# EAGLE design Main_board_revE (EAGLE 7.0.0)
DEDuino Main Board allows connection between an Arduino and the other components ive simple 6 pin cables
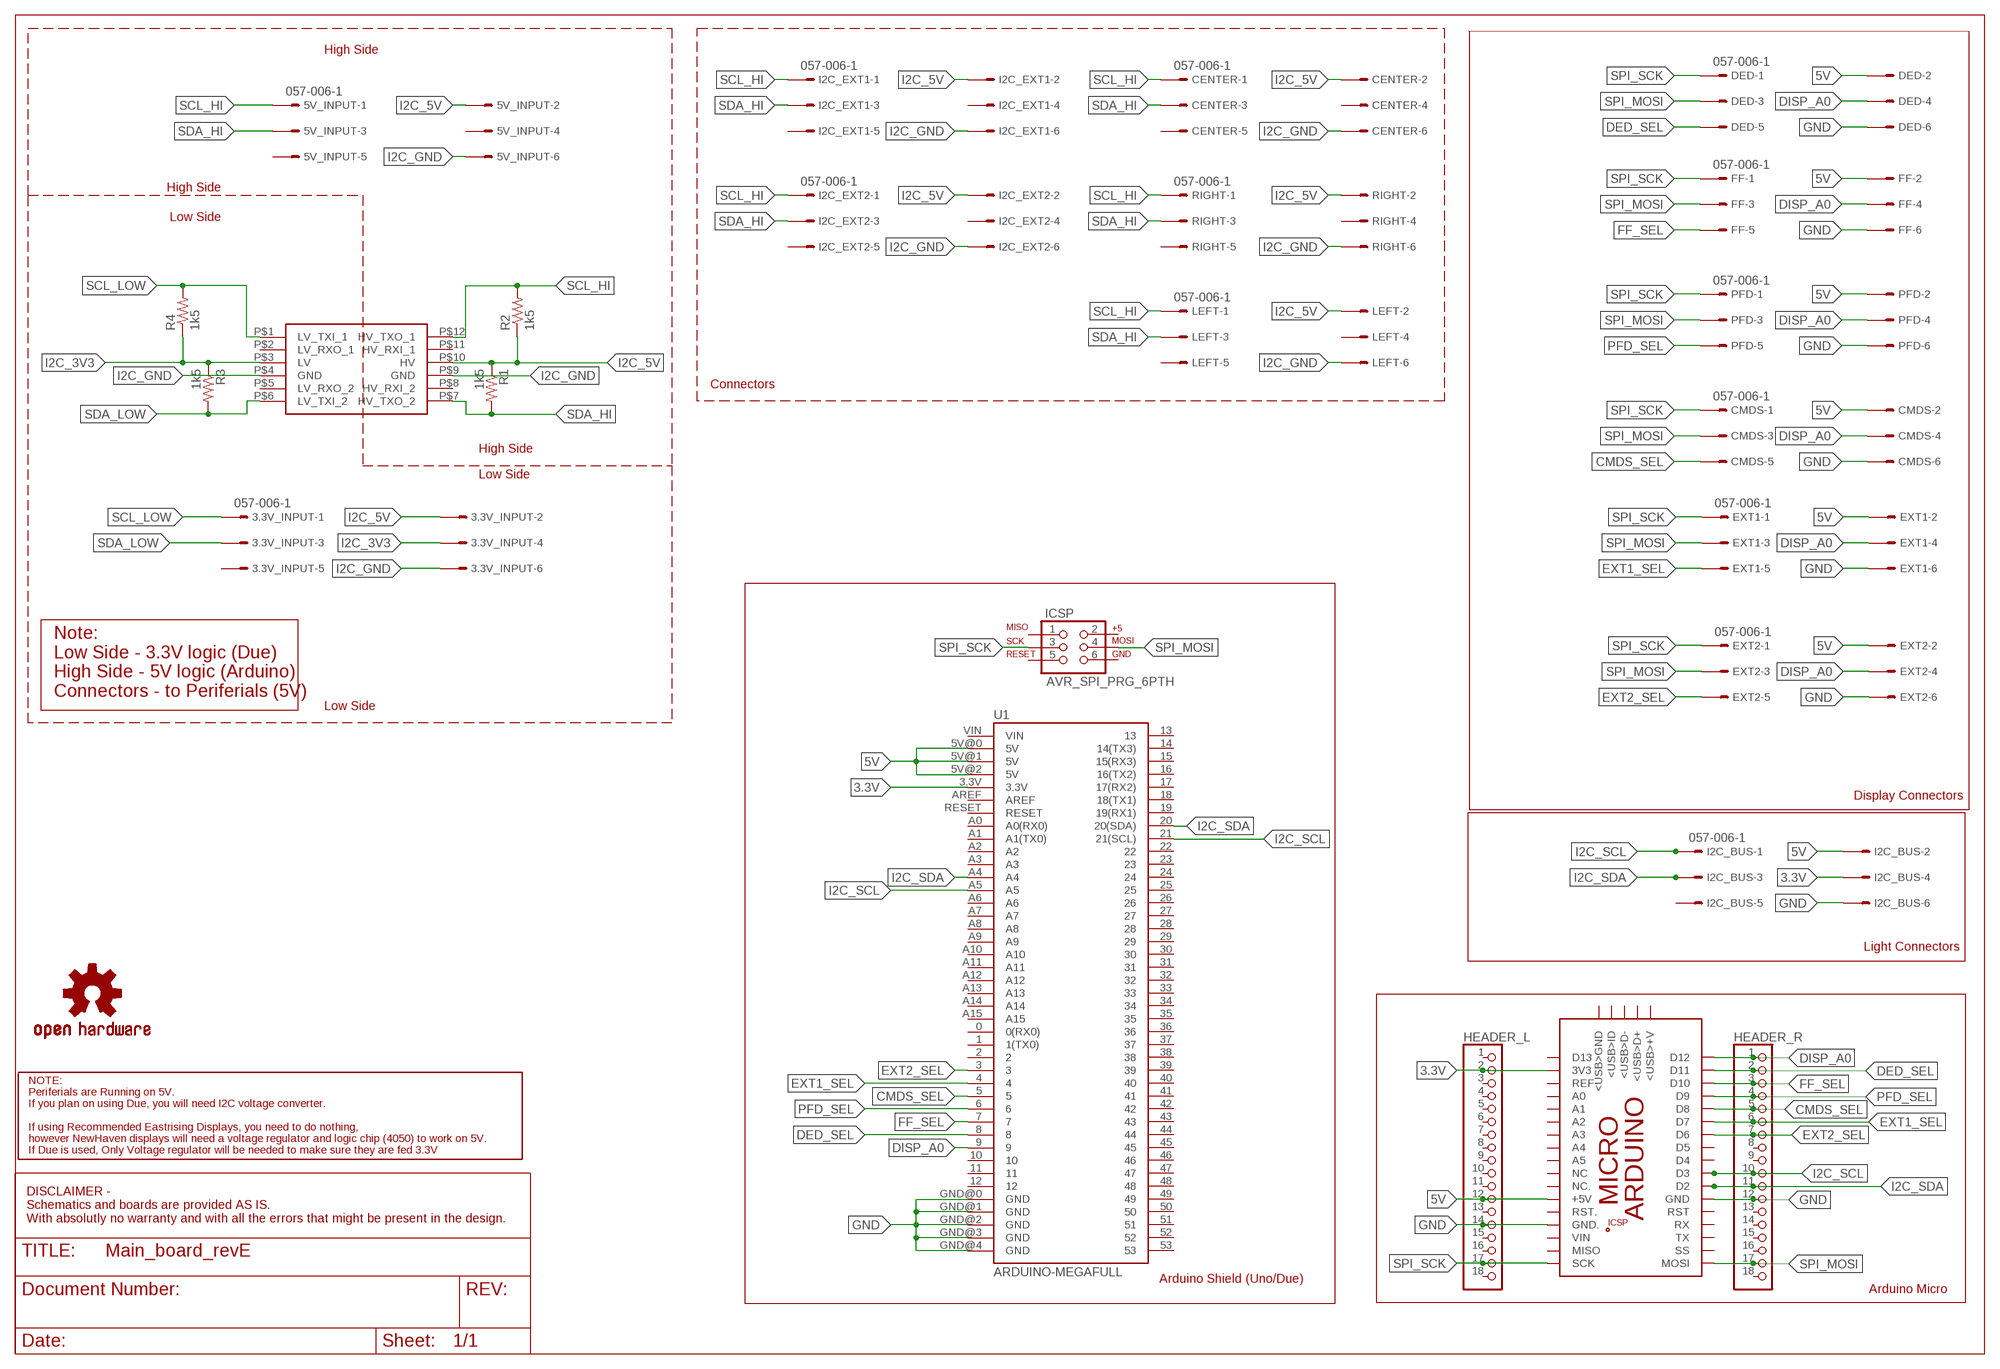
[diagram p0: schematic, sheet 1]

## Parts
3.3V_INPUT  057-006-1  [057-006-1]
5V_INPUT  057-006-1  [057-006-1]
CENTER  057-006-1  [057-006-1]
CMDS  057-006-1  [057-006-1]
DED  057-006-1  [057-006-1]
EXT1  057-006-1  [057-006-1]
EXT2  057-006-1  [057-006-1]
FF  057-006-1  [057-006-1]
HEADER_L  PINHD-1X18  [1X18]
HEADER_R  PINHD-1X18  [1X18]
I2C_BUS  057-006-1  [057-006-1]
I2C_EXT1  057-006-1  [057-006-1]
I2C_EXT2  057-006-1  [057-006-1]
ICSP  AVR_SPI_PRG_6PTH  [2X3]
LEFT  057-006-1  [057-006-1]
LOGO1  OSHW-LOGOM  [OSHW-LOGO-M]
PCB1  ARDUINO_MICRO_EXT  (no package)
PFD  057-006-1  [057-006-1]
R1  1k5  RESISTOR0805-RES  [0805]
R2  1k5  RESISTOR0805-RES  [0805]
R3  1k5  RESISTOR0805-RES  [0805]
R4  1k5  RESISTOR0805-RES  [0805]
RIGHT  057-006-1  [057-006-1]
U1  ARDUINO-MEGAFULL  [ARDUINO_MEGA]
U$1  LOGIC_LEVEL_CONVERTER  [LOGIC_LEVEL_CONVERTER]

## Nets
3.3V [Power]: HEADER_L.2 I2C_BUS.4 PCB1.3V3 U1.3.3V
5V [Power]: CMDS.2 DED.2 EXT1.2 EXT2.2 FF.2 HEADER_L.12 I2C_BUS.2 PCB1.+5V PFD.2 U1.5V@0(5V) U1.5V@1(5V) U1.5V@2(5V)
CMDS_SEL [Normal]: CMDS.5 HEADER_R.5 PCB1.D8 U1.5
DED_SEL [Normal]: DED.5 HEADER_R.2 PCB1.D11 U1.8
DISP_A0 [Normal]: CMDS.4 DED.4 EXT1.4 EXT2.4 FF.4 HEADER_R.1 PCB1.D12 PFD.4 U1.9
EXT1_SEL [Normal]: EXT1.5 HEADER_R.6 PCB1.D7 U1.4
EXT2_SEL: EXT2.5 HEADER_R.7 PCB1.D6 U1.3
FF_SEL [Normal]: FF.5 HEADER_R.3 PCB1.D10 U1.7
GND [Power]: CMDS.6 DED.6 EXT1.6 EXT2.6 FF.6 HEADER_L.14 HEADER_R.12 I2C_BUS.6 PCB1.GND PCB1.GND. PFD.6 U1.GND@0(GND) U1.GND@1(GND) U1.GND@2(GND) U1.GND@3(GND) U1.GND@4(GND)
I2C_3V3 [Power]: 3.3V_INPUT.4 R3.1 R4.1 U$1.P$3(LV)
I2C_5V [Power]: 3.3V_INPUT.2 5V_INPUT.2 CENTER.2 I2C_EXT1.2 I2C_EXT2.2 LEFT.2 R1.1 R2.1 RIGHT.2 U$1.P$10(HV)
I2C_GND [Power]: 3.3V_INPUT.6 5V_INPUT.6 CENTER.6 I2C_EXT1.6 I2C_EXT2.6 LEFT.6 RIGHT.6 U$1.P$4(GND) U$1.P$9(GND)
I2C_SCL [Normal]: HEADER_R.10 I2C_BUS.1 PCB1.D3 U1.21(21(SCL)) U1.A5
I2C_SDA [Normal]: HEADER_R.11 I2C_BUS.3 PCB1.D2 U1.20(20(SDA)) U1.A4
PFD_SEL [Normal]: HEADER_R.4 PCB1.D9 PFD.5 U1.6
SCL_HI [Normal]: 5V_INPUT.1 CENTER.1 I2C_EXT1.1 I2C_EXT2.1 LEFT.1 R2.2 RIGHT.1 U$1.P$12(HV_TXO_1)
SCL_LOW [Normal]: 3.3V_INPUT.1 R4.2 U$1.P$1(LV_TXI_1)
SDA_HI [Normal]: 5V_INPUT.3 CENTER.3 I2C_EXT1.3 I2C_EXT2.3 LEFT.3 R1.2 RIGHT.3 U$1.P$7(HV_TXO_2)
SDA_LOW [Normal]: 3.3V_INPUT.3 R3.2 U$1.P$6(LV_TXI_2)
SPI_MOSI [Normal]: CMDS.3 DED.3 EXT1.3 EXT2.3 FF.3 HEADER_R.17 ICSP.4 PCB1.MOSI PFD.3
SPI_SCK [Normal]: CMDS.1 DED.1 EXT1.1 EXT2.1 FF.1 HEADER_L.17 ICSP.3 PCB1.SCK PFD.1
Unconnected: 3.3V_INPUT.5 5V_INPUT.4 5V_INPUT.5 CENTER.4 CENTER.5 HEADER_L.1 HEADER_L.3 HEADER_L.4 HEADER_L.5 HEADER_L.6 HEADER_L.7 HEADER_L.8 HEADER_L.9 HEADER_L.10 HEADER_L.11 HEADER_L.13 HEADER_L.15 HEADER_L.16 HEADER_L.18 HEADER_R.8 HEADER_R.9 HEADER_R.13 HEADER_R.14 HEADER_R.15 HEADER_R.16 HEADER_R.18 I2C_BUS.5 I2C_EXT1.4 I2C_EXT1.5 I2C_EXT2.4 I2C_EXT2.5 ICSP.1 ICSP.2 ICSP.5 ICSP.6 LEFT.4 LEFT.5 PCB1.5V PCB1.<USB>+V PCB1.<USB>D+ PCB1.<USB>D- PCB1.<USB>GND PCB1.<USB>ID PCB1.A0 PCB1.A1 PCB1.A2 PCB1.A3 PCB1.A4 PCB1.A5 PCB1.D4 PCB1.D5 PCB1.D13 PCB1.GND_ PCB1.MISO PCB1.MISO. PCB1.MOSI. PCB1.NC PCB1.NC. PCB1.REF PCB1.RESET.. PCB1.RST PCB1.RST. PCB1.RX PCB1.SCK. PCB1.SS PCB1.TX PCB1.VIN RIGHT.4 RIGHT.5 U1.0(0(RX0)) U1.1(1(TX0)) U1.2 U1.10 U1.11 U1.12 U1.13 U1.14(14(TX3)) U1.15(15(RX3)) U1.16(16(TX2)) U1.17(17(RX2)) U1.18(18(TX1)) U1.19(19(RX1)) U1.22 U1.23 U1.24 U1.25 U1.26 U1.27 U1.28 U1.29 U1.30 U1.31 U1.32 U1.33 U1.34 U1.35 U1.36 U1.37 U1.38 U1.39 U1.40 U1.41 U1.42 U1.43 U1.44 U1.45 U1.46 U1.47 U1.48 U1.49 U1.50 U1.51 U1.52 U1.53 U1.A0(A0(RX0)) U1.A1(A1(TX0)) U1.A2 U1.A3 U1.A6 U1.A7 U1.A8 U1.A9 U1.A10 U1.A11 U1.A12 U1.A13 U1.A14 U1.A15 U1.AREF U1.RESET U1.VIN U$1.P$2(LV_RXO_1) U$1.P$5(LV_RXO_2) U$1.P$8(HV_RXI_2) U$1.P$11(HV_RXI_1)

## Notes on the sheet
- High Side
- High Side
- Low Side
- Connectors
- High Side
- Low Side
- Note:
  Low Side - 3.3V logic (Due)
  High Side - 5V logic (Arduino)
  Connectors - to Periferials (5V)
- Low Side
- Display Connectors
- Light Connectors
- NOTE:
  Periferials are Running on 5V.
  If you plan on using Due, you will need I2C voltage converter.
  
  If using Recommended Eastrising Displays, you need to do nothing,
  however NewHaven displays will need a voltage regulator and logic chip (4050) to work on 5V.
  If Due is used, Only Voltage regulator will be needed to make sure they are fed 3.3V
- DISCLAIMER - 
  Schematics and boards are provided AS IS.
  With absolutly no warranty and with all the errors that might be present in the design.
- Arduino Shield (Uno/Due)
- Arduino Micro

## Library data of the parts
3.3V_INPUT 5V_INPUT CENTER CMDS DED EXT1 EXT2 FF I2C_BUS I2C_EXT1 I2C_EXT2 LEFT PFD RIGHT = con-panduit:057-006-: CONNECTOR 6-pin series 057 contact pc board low profile headers; OC_FARNELL: unknown; OC_NEWARK: unknown
HEADER_L HEADER_R = pinhead:PINHD-1X18: PIN HEADER
ICSP = SparkFun-Connectors:AVR_SPI_PRG_6: AVR ISP 6 Pin This is the reduced ISP connector for AVR programming. Common on Arduino. This footprint will take up less PCB space and can be used with a 10-pin to 6-pin adapter such as SKU: BOB-08508 **Special note about "TEST_POINT" package. The stop mask is on the top side, so if you want your programming test points to be on the bottom of your board, make sure to place this package on the bottom side of the board. This also ensure that the orientation to program from the bottom side will be correct.
LOGO1 = SparkFun-Aesthetics:OSHW-LOGO: Open Source Hardware Logo This logo indicates the piece of hardware it is found on incorporates a OSHW license and/or adheres to the definition of open source hardware found here: http://freedomdefined.org/OSHW
PCB1 = E14_Arduino_published:ARDUINO_MICRO_EXT: Device for representing an Arduino Micro board in an EAGLE design without the PCB footprint. Created by Dave Young for Element14. More EAGLE documentation at: http://www.element14.com/community/community/knode/cadsoft_eagle
R1-R4 = SparkFun-Passives:RESISTOR: Resistor Basic schematic elements and footprints for 0603, 1206, and PTH resistors.
U1 = SparkFun-Boards:ARDUINO-MEGA: Arduino Mega board footprint
U$1 = SparkFun-Boards:LOGIC_LEVEL_CONVERTER: Logic Level Converter (3.3v - 5v) https://www.sparkfun.com/products/8745

## Net classes
1 Power: width 0.406 mm, drill 0.406 mm, clearance 0.406 mm
2 Normal: width 0.254 mm, drill 0.254 mm, clearance 0.254 mm

## Board
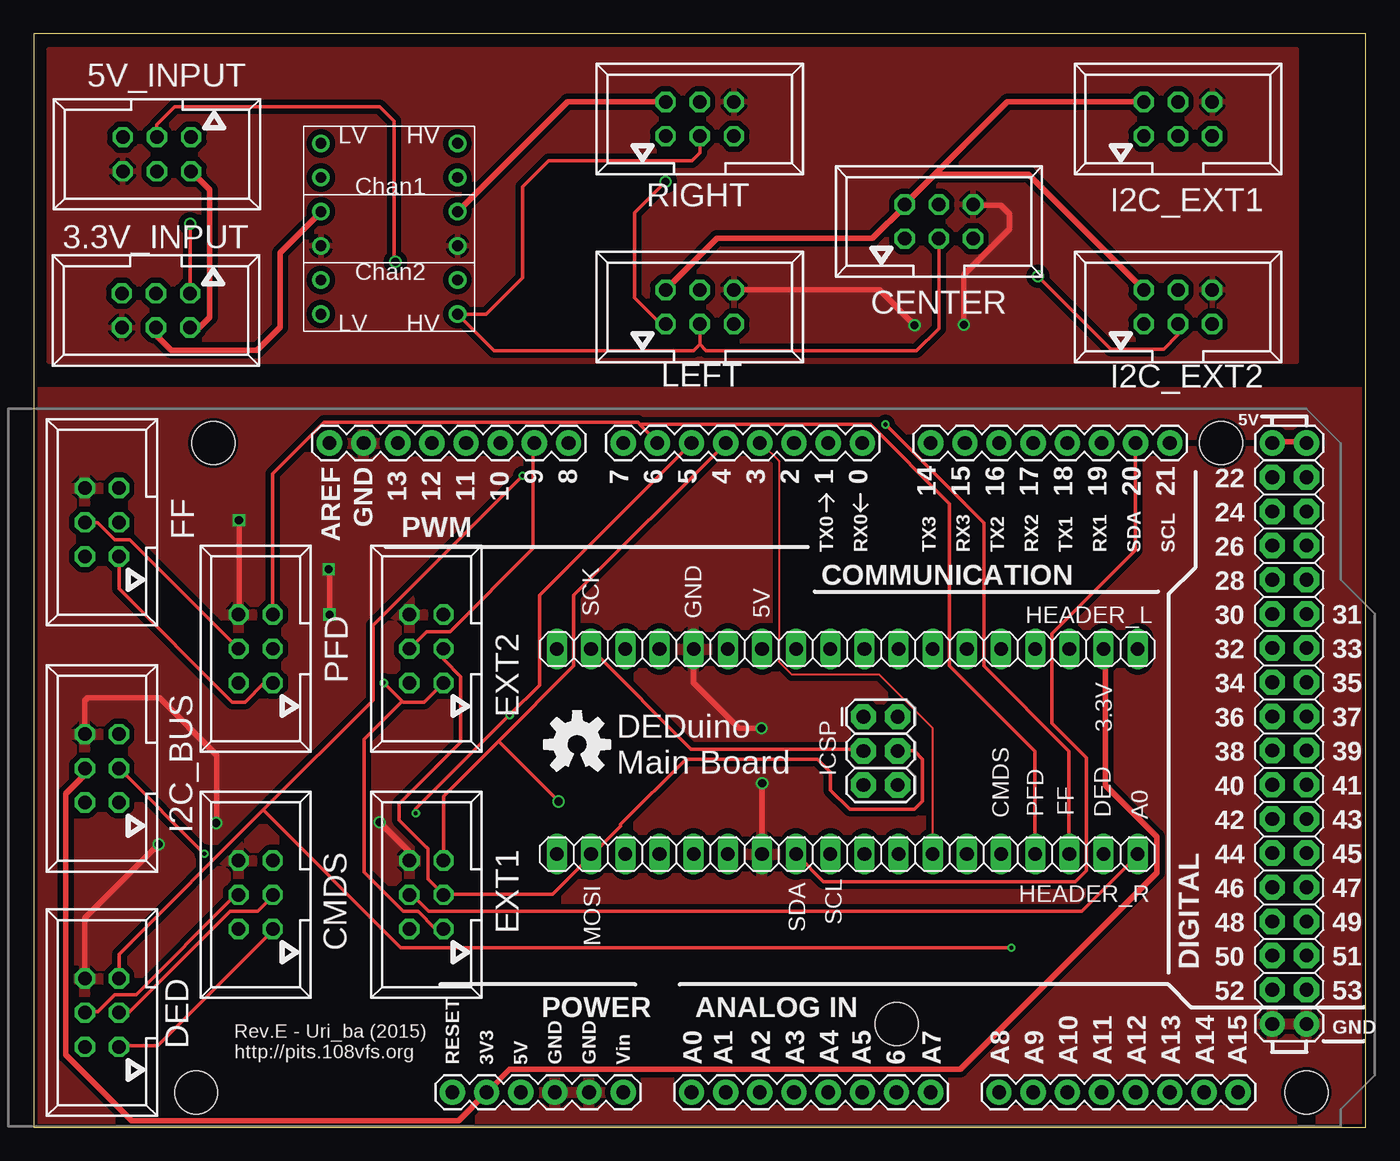
[diagram p1: board, top side]
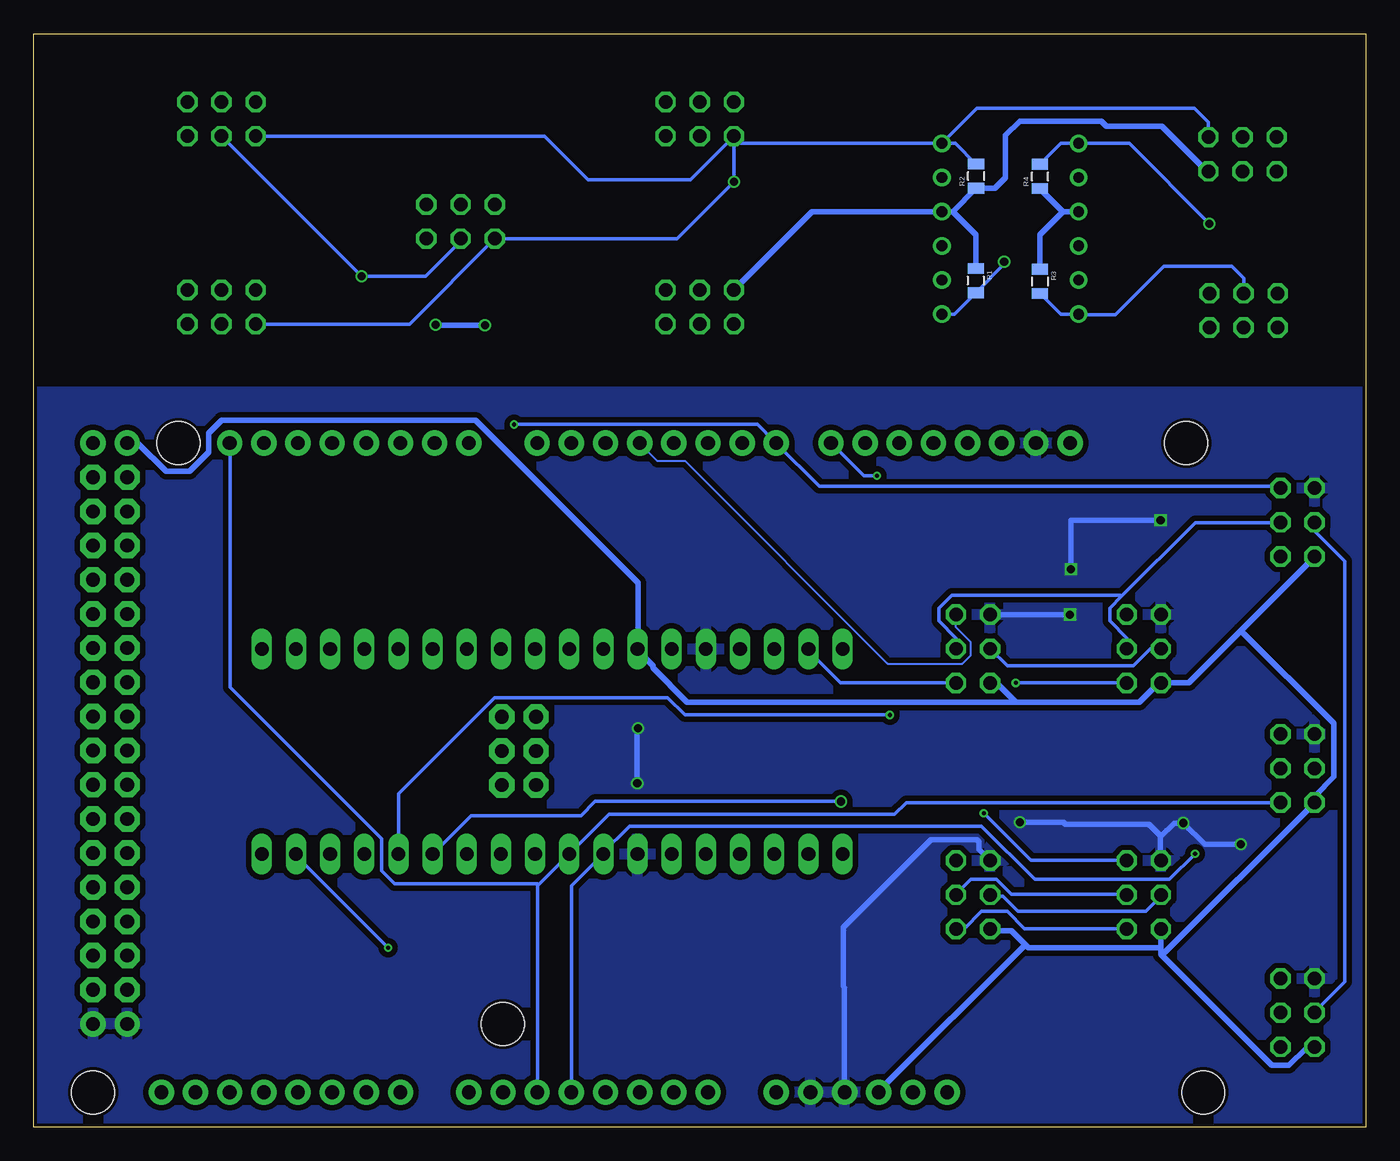
[diagram p2: board, bottom side, seen from below]

Size 99.06 x 81.28 mm. Coordinates in mm from the lower left corner, seen from the top.
Outline: 0,0 99.06,0 99.06,81.28 0,81.28 0,0
Copper layers (1*16): Top 0.035mm / dielectric 1.5mm / Bottom 0.035mm
Design rules "ITEADstudio_DRC": minimum track width 6mil, minimum drill 12mil, track to track 6mil, track to pad 6mil, pad to pad 6mil, via to via 6mil, smd to smd 0mil, copper to edge 10mil, drill to drill 10mil, minimum pad ring 10mil, minimum via ring 6mil, stop-mask expansion 2mil, vias tented up to drill 100mil, thermal gap 10mil

### Footprints (pad centres in the part's own frame; a part is rotated, then mirrored left to right if it is on the bottom)
057-006-1 = drill 1 octagon: 1 -2.54,-1.27; 2 -2.54,1.27; 3 0,-1.27; 4 0,1.27; 5 2.54,-1.27; 6 2.54,1.27
1X18 = drill 1.016 long: 1 -21.59,0; 2 -19.05,0; 3 -16.51,0; 4 -13.97,0; 5 -11.43,0; 6 -8.89,0; 7 -6.35,0; 8 -3.81,0; 9 -1.27,0; 10 1.27,0; 11 3.81,0; 12 6.35,0; 13 8.89,0; 14 11.43,0; 15 13.97,0; 16 16.51,0; 17 19.05,0; 18 21.59,0
2X3 = drill 1.016 pad 1.88 octagon: 1 0,0; 2 0,2.54; 3 2.54,0; 4 2.54,2.54; 5 5.08,0; 6 5.08,2.54
0805 = smd 0.8 x 1.2: 1 -0.9,0; 2 0.9,0
ARDUINO_MEGA = drill 1.016 pad 1.88: 0 63.5,50.8; 1 60.96,50.8; 2 58.42,50.8; 3 55.88,50.8; 3.3V 35.56,2.54; 4 53.34,50.8; 5 50.8,50.8; 5V@0 38.1,2.54; 5V@1 93.98,50.8; 5V@2 96.52,50.8; 6 48.26,50.8; 7 45.72,50.8; 8 41.656,50.8; 9 39.116,50.8; 10 36.576,50.8; 11 34.036,50.8; 12 31.496,50.8; 13 28.956,50.8; 14 68.58,50.8; 15 71.12,50.8; 16 73.66,50.8; 17 76.2,50.8; 18 78.74,50.8; 19 81.28,50.8; 20 83.82,50.8; 21 86.36,50.8; A0 50.8,2.54; A1 53.34,2.54; A2 55.88,2.54; A3 58.42,2.54; A4 60.96,2.54; A5 63.5,2.54; A6 66.04,2.54; A7 68.58,2.54; A8 73.66,2.54; A9 76.2,2.54; A10 78.74,2.54; A11 81.28,2.54; A12 83.82,2.54; A13 86.36,2.54; A14 88.9,2.54; A15 91.44,2.54; AREF 23.876,50.8; GND@0 40.64,2.54; GND@1 43.18,2.54; GND@2 93.98,7.62; GND@3 96.52,7.62; GND@4 26.416,50.8; RESET 33.02,2.54; VIN 45.72,2.54 | drill 1.016 pad 1.88 octagon: 22 93.98,48.26; 23 96.52,48.26; 24 93.98,45.72; 25 96.52,45.72; 26 93.98,43.18; 27 96.52,43.18; 28 93.98,40.64; 29 96.52,40.64; 30 93.98,38.1; 31 96.52,38.1; 32 93.98,35.56; 33 96.52,35.56; 34 93.98,33.02; 35 96.52,33.02; 36 93.98,30.48; 37 96.52,30.48; 38 93.98,27.94; 39 96.52,27.94; 40 93.98,25.4; 41 96.52,25.4; 42 93.98,22.86; 43 96.52,22.86; 44 93.98,20.32; 45 96.52,20.32; 46 93.98,17.78; 47 96.52,17.78; 48 93.98,15.24; 49 96.52,15.24; 50 93.98,12.7; 51 96.52,12.7; 52 93.98,10.16; 53 96.52,10.16 | hole 3.2: 15.24,50.8; 13.97,2.54; 66.04,7.62; 90.17,50.8; 96.52,2.54
LOGIC_LEVEL_CONVERTER = drill 0.8: P$1 1.27,13.97; P$2 1.27,11.43; P$3 1.27,8.89; P$4 1.27,6.35; P$5 1.27,3.81; P$6 1.27,1.27; P$7 11.43,1.27; P$8 11.43,3.81; P$9 11.43,6.35; P$10 11.43,8.89; P$11 11.43,11.43; P$12 11.43,13.97

### Placement (x,y rotation side)
3.3V_INPUT  9.09,60.71 180 top
5V_INPUT  9.17,72.31 180 top
CENTER  67.31,67.31 0 top
CMDS  16.51,17.27 90 top
DED  5.08,8.51 90 top
EXT1  29.21,17.27 90 top
EXT2  29.21,35.56 90 top
FF  5.08,44.96 90 top
HEADER_L  60.5,35.53 180 top
HEADER_R  60.5,20.29 180 top
I2C_BUS  5.08,26.67 90 top
I2C_EXT1  85.09,74.93 0 top
I2C_EXT2  85.09,60.96 0 top
ICSP  61.7,30.51 270 top
LEFT  49.53,60.96 0 top
LOGO1  40.41,28.45 0 top
PFD  16.51,35.56 90 top
R1  29.01,62.92 270 bottom
R2  28.98,70.69 90 bottom
R3  24.23,62.87 270 bottom
R4  24.23,70.66 90 bottom
RIGHT  49.53,74.93 0 top
U1  -1.88,0.05 0 top
U$1  20.09,59.16 0 top

### Tracks (layer width: path | path; a pad name or v marks a point on that pad's centre or on a via)
3.3V
  Top 0.406: I2C_BUS.4 3.81,26.19 2.38,24.77 2.38,5.4 7.3,0.48 31.59,0.48 33.66,2.54 U1.3.3V 33.81,2.7 35.4,4.29 68.9,4.29 83.5,18.89 83.5,21.59 79.69,25.4 79.69,35.4 HEADER_L.2
5V
  Top 0.406: U1.5V@1 92.23,50.96 94.61,50.96 U1.5V@2
  Bottom 0.406: 15.16,12.78 15.24,12.86 15.24,13.34 | 15.16,12.78 6.99,4.6 5.71,4.6 4.45,5.87 3.81,5.87 DED.2 | CMDS.2 15.24,13.34 | 15.16,12.78 I2C_BUS.2 3.81,24.61 2.38,26.04 2.38,30 9.29,36.91 | 25.32,13.57 25.08,13.34 15.24,13.34 | 25.32,13.57 26.35,14.61 27.94,14.61 EXT1.2 | 25.32,13.57 36.2,2.7 U1.5V@0 | 9.29,36.91 3.81,42.39 FF.2 | 9.29,36.91 13.18,33.02 PFD.2 15.4,33.02 16.83,31.59 26.04,31.59 26.11,31.67 | EXT2.2 27.46,33.02 26.11,31.67 | 26.11,31.67 26.19,31.59 50.48,31.59 53.02,34.13 53.02,34.29 54.13,35.4 HEADER_L.12 54.13,35.72 54.13,40.48 66.2,52.55 85.09,52.55 86.04,51.59 86.04,50.16 87.47,48.74 89.22,48.74 91.28,50.8 92.08,50.8 U1.5V@1
CMDS_SEL  (via drill 0.3)
  Top 0.254: v28.42,23.34 28.42,23.65 v35.4,30.64 37.62,32.86 37.62,39.53 48.9,50.8 U1.5
  Bottom 0.254: v28.42,23.34 24.92,19.84 17.78,19.84 CMDS.5 | v35.4,30.64 50.64,30.64 51.91,31.91 64.77,31.91 71.91,24.77 71.91,20.32 HEADER_R.5
DED_SEL  (via drill 0.3)
  Top 0.254: DED.5 6.35,12.86 17.07,23.57 | 17.07,23.57 25.24,31.75 25.24,37.31 v36.35,48.42 | v72.71,13.34 27.3,13.34 17.07,23.57
  Bottom 0.254: v36.35,48.42 37.31,48.42 39.69,50.8 U1.8 | v72.71,13.34 79.53,20.16 HEADER_R.2
DISP_A0
  Top 0.254: PFD.4 7.14,43.66 6.03,43.66 4.76,44.93 3.81,44.93 FF.4 | EXT2.4 29.21,36.83 30.96,36.83 37.15,43.02 37.15,50.8 U1.9 | DED.4 3.81,8.57 4.76,8.57 6.03,9.84 7.62,9.84 14.92,17.14 15.24,17.14 CMDS.4 | HEADER_R.1 82.07,20.16 77.95,16.03 29.37,16.03 28.26,17.14 27.94,17.14 EXT1.4
  Bottom 0.254: PFD.4 16.03,35.56 17.3,34.29 26.67,34.29 EXT2.4 | EXT1.4 27.94,17.14 26.99,17.14 25.88,16.03 16.35,16.03 15.24,17.14 CMDS.4 | FF.4 3.81,44.29 1.59,42.07 1.59,10.79 3.81,8.57 DED.4
EXT1_SEL  (via drill 0.6)
  Top 0.254: EXT1.5 30.48,24.61 34.57,28.7 | 34.57,28.7 40.16,34.29 40.16,39.53 51.44,50.8 U1.4 | v39.04,24.21 39.04,24.23 34.57,28.7
  Bottom 0.254: 69.37,20.32 HEADER_R.6 66.52,23.16 58.37,23.16 57.33,24.21 v39.04,24.21
EXT2_SEL
  Top 0.152: HEADER_R.7 66.83,20.32 66.83,29.69 62.87,33.66 56.36,33.66 55.4,34.61 55.4,49.53 54.13,50.8 U1.3
  Bottom 0.152: EXT2.5 30.48,37.15 29.37,36.04 29.37,35.08 30,34.45 35.56,34.45 50.64,49.53 52.7,49.53 53.98,50.8 U1.3
FF_SEL  (via drill 0.3)
  Top 0.254: v63.34,52.23 70.64,44.93 70.64,34.29 76.99,27.94 76.99,20.32 HEADER_R.3
  Bottom 0.254: FF.5 6.35,47.62 40.64,47.62 43.81,50.8 U1.7 43.97,50.96 45.24,52.23 v63.34,52.23
GND  (via drill 0.6)
  Top 0.406: PFD.6 15.27,38.1 v15.27,45.11 | v21.95,41.48 22,41.48 v22,38.1 | EXT1.6 27.94,20.45 v25.73,22.66 | HEADER_R.12 54.15,25.53 v54.18,25.55 | v54.13,29.64 52.45,29.64 49.07,33.02 49.07,34.54 49.12,34.59 49.12,35.48 HEADER_L.14 | I2C_BUS.6 3.81,31.7 4.01,31.9 9.37,31.9 13.61,27.66 13.61,22.66 v13.56,22.61 | DED.6 3.81,15.54 v9.3,21.03
  Bottom 0.406: v15.27,45.11 21.95,45.11 v21.95,41.48 | v22,38.1 EXT2.6 | U1.GND@0 38.76,10.36 38.86,10.46 38.86,14.86 32.36,21.36 28.93,21.36 28.78,21.21 28.78,20.65 EXT1.6 | v25.73,22.66 22.48,22.66 22.35,22.53 16.13,22.53 15.27,21.67 15.27,21.59 | 15.27,21.59 15.27,19.84 CMDS.6 | v54.18,25.55 54.18,29.59 v54.13,29.64 | 15.27,21.59 14.25,22.61 v13.56,22.61 11.99,21.03 v9.3,21.03
  pour Bottom: -1.27,54.61 102.87,54.61 102.87,-1.27 -1.27,-1.27
  pour Top: 0,54.61 101.6,54.61 101.6,0 0,0
I2C_3V3
  Top 0.406: 3.3V_INPUT.4 9.09,58.9 10.24,57.76 16.61,57.76 18.31,59.46 18.31,65 U$1.P$3
  Bottom 0.406: R4.1 22.52,68.05 | 22.52,68.05 U$1.P$3 | R3.1 24.23,66.33 22.52,68.05
I2C_5V
  Top 0.406: 3.3V_INPUT.2 12.32,59.44 13.08,60.2 13.08,69.67 5V_INPUT.2 | 67,70.81 CENTER.2 64.77,68.45 62.38,66.06 50.83,66.06 LEFT.2 | 67,70.81 72.39,76.2 I2C_EXT1.2 | I2C_EXT2.2 73.97,70.81 67,70.81 | RIGHT.2 47.02,76.22 | 47.02,76.22 47.07,76.22 | 47.02,76.22 39.7,76.22 U$1.P$10
  Bottom 0.406: 30.72,68.05 R2.1 27.58,69.8 26.8,70.59 26.8,73.71 25.73,74.78 19.66,74.78 19.28,74.4 15.19,74.4 11.84,71.04 5V_INPUT.2 | 30.72,68.05 U$1.P$10 | U$1.P$10 30.79,68.05 | R1.1 29.01,66.33 30.72,68.05 | U$1.P$10 41.17,68.05 LEFT.2
I2C_GND  (via drill 0.6)
  Top 0.406: LEFT.6 62.89,62.23 v65.51,59.61 | v69.16,59.64 69.16,63.37 72.54,66.75 72.54,67.89 71.91,68.53 69.9,68.53 CENTER.6
  Bottom 0.406: v65.51,59.61 69.14,59.61 v69.16,59.64
  pour Top: 1.14,80.09 93.9,80.09 93.9,56.95 1.14,56.95 1.14,79.91
I2C_SCL
  Bottom 0.254: 61.52,18.02 59.37,20.16 HEADER_R.10 59.21,20.32 56.29,23.24 35.05,23.24 34.16,24.13 I2C_BUS.1 | 61.52,18.02 61.59,17.94 61.59,2.7 U1.A5 | U1.21 84.45,50.8 84.45,32.7 73.18,21.43 73.18,19.05 72.23,18.1 61.59,18.1 61.52,18.02
I2C_SDA  (via drill 0.3)
  Top 0.254: v12.7,20.32 I2C_BUS.3 | U1.20 81.92,50.8 81.92,42.86 75.72,36.67 75.72,30 78.26,27.46 78.26,19.05 77.47,18.26 58.74,18.26 56.83,20.16 HEADER_R.11
  Bottom 0.254: v12.7,20.32 14.61,18.41 24.61,18.41 28.57,22.38 54.77,22.38 56.83,20.32 HEADER_R.11 56.83,20.16 59.05,17.94 59.05,2.7 U1.A4
PFD_SEL
  Top 0.254: PFD.5 17.78,48.58 21.59,52.39 44.93,52.39 45.16,52.15 | 45.16,52.15 46.35,50.96 U1.6 | HEADER_R.4 74.45,20.32 74.45,27.94 68.1,34.29 68.1,46.35 62.23,52.23 45.24,52.23 45.16,52.15
SCL_HI  (via drill 0.6)
  Top 0.254: LEFT.1 46.63,59.69 44.68,61.65 44.68,67.97 v46.99,70.28
  Bottom 0.254: U$1.P$12 30.52,73.13 R2.2 | 5V_INPUT.1 11.71,74.7 12.75,75.74 28.91,75.74 U$1.P$12 | U$1.P$12 46.46,73.13 RIGHT.1 | I2C_EXT2.1 71.12,59.69 CENTER.1 51.23,66.04 v46.99,70.28 RIGHT.1 | I2C_EXT1.1 61.06,73.66 57.84,70.43 50.22,70.43 RIGHT.1
SCL_LOW  (via drill 0.6)
  Top 0.254: v11.63,67.16 3.3V_INPUT.1
  Bottom 0.254: R4.2 22.67,73.13 U$1.P$1 17.6,73.13 v11.63,67.16
SDA_HI  (via drill 0.6)
  Top 0.254: LEFT.3 49.53,58.19 | 49.53,58.19 49.05,57.71 34.24,57.71 U$1.P$7 33.66,60.43 36.37,63.14 36.37,69.9 38.3,71.83 48.95,71.83 49.53,72.42 RIGHT.3 | CENTER.3 67.31,59.36 65.66,57.71 50.01,57.71 49.53,58.19 | 5V_INPUT.3 9.17,74.52 10.49,75.84 25.73,75.84 26.8,74.78 26.8,64.41 v26.9,64.31 | v74.68,63.25 80.09,57.84 84.02,57.84 85.09,58.9 I2C_EXT2.3
  Bottom 0.254: 31.67,60.38 31.62,60.43 U$1.P$7 30.6,60.43 R1.2 26.9,64.12 v26.9,64.31 | I2C_EXT1.3 v74.68,63.25 69.9,63.25 67.31,65.84 CENTER.3
SDA_LOW
  Bottom 0.254: R3.2 22.69,60.43 U$1.P$6 21.34,60.4 18.62,60.4 15.04,63.98 9.98,63.98 9.09,63.09 3.3V_INPUT.3
SPI_MOSI
  Top 0.254: DED.3 6.35,8.57 7.14,8.57 14.61,16.03 16.67,16.03 17.78,17.14 CMDS.3 | 64.29,27.94 ICSP.4 65.48,27.96 66.09,27.36 66.09,24.23 65.48,23.62 60.68,23.62 59.26,25.04 59.26,26.36 58.27,27.36 48.51,27.36 43.66,22.5 43.66,22.38 41.59,20.32 HEADER_R.17 41.43,20.16 38.58,17.3 30.48,17.3 EXT1.3 29.34,18.41 29.34,20.68 29.21,20.8 29.18,20.8 27.18,22.81 27.18,24.03 31.75,28.6 31.75,33.5 30.48,34.77 EXT2.3
  Bottom 0.254: PFD.3 17.78,36.35 19.05,37.62 19.05,38.58 18.18,39.45 | 18.18,39.45 12.7,44.93 6.35,44.93 FF.3 | EXT2.3 30.48,36.35 31.75,37.62 31.75,38.58 30.8,39.53 18.26,39.53 18.18,39.45 | CMDS.3 17.78,17.3 26.35,17.3 27.46,18.41 29.37,18.41 30.48,17.3 EXT1.3
SPI_SCK  (via drill 0.3)
  Top 0.254: DED.1 6.35,6.03 9.21,6.03 17.78,14.61 CMDS.1 | PFD.1 17.14,33.02 15.72,31.59 14.76,31.59 6.35,40.01 FF.1 | ICSP.3 61.59,28.1 48.9,28.1 41.59,35.4 HEADER_L.17 | 27.38,31.67 27.46,31.59 29.05,31.59 EXT2.1 | 27.38,31.67 v26.04,33.02 | 27.38,31.67 24.56,28.85 24.56,18.94 27.46,16.03 28.57,16.03 29.84,14.76 30.48,14.76 EXT1.1
  Bottom 0.254: EXT1.1 30.48,14.76 29.84,14.76 28.57,16.03 26.67,16.03 25.4,14.76 17.78,14.76 CMDS.1 | EXT2.1 39.05,33.02 41.43,35.4 HEADER_L.17 | v26.04,33.02 PFD.1

### Text on the board
tNames: SCK | GND | 5V | 3.3V | DEDuino / Main Board | CMDS | PFD | FF | DED | A0 | SDA | SCL | MOSI | Rev.E - Uri_ba (2015) / http://pits.108vfs.org | GND